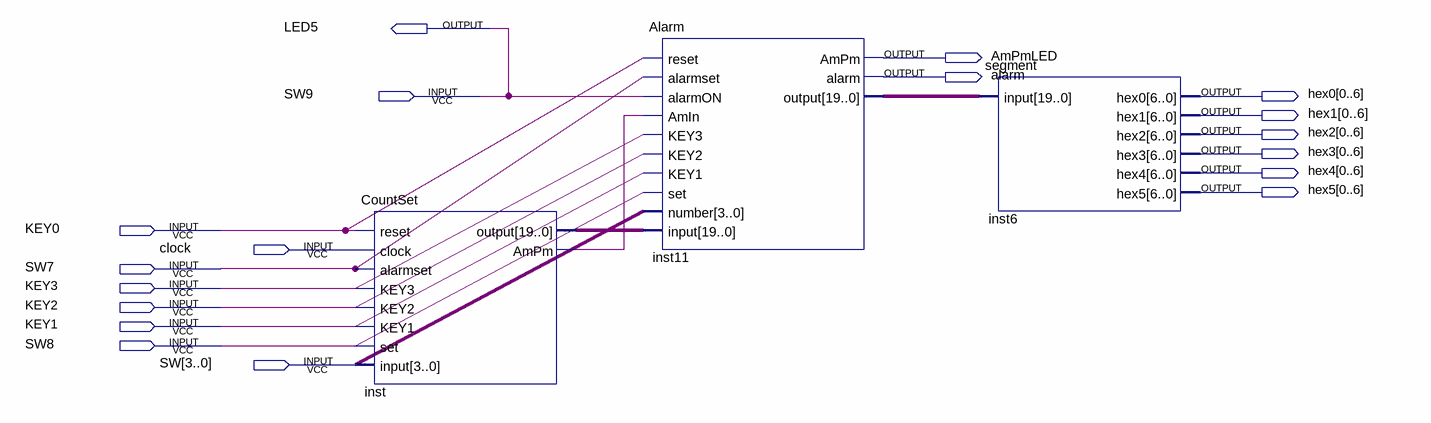
[diagram p0: schematic sheet]
// Quartus schematic Lab3.bdf as structural Verilog: 3 symbols, 18 pins
module Lab3 (
  input  SW9,
  input  KEY0,
  input  clock,
  input  SW7,
  input  KEY3,
  input  KEY2,
  input  KEY1,
  input  SW8,
  input  [3:0] SW,
  output LED5,
  output AmPmLED,
  output alarm,
  output [0:6] hex0,
  output [0:6] hex1,
  output [0:6] hex2,
  output [0:6] hex3,
  output [0:6] hex4,
  output [0:6] hex5
);

  wire inst_ampm;
  wire [19:0] inst11_output, inst_output;

  CountSet inst (
    .reset(KEY0), .clock(clock), .alarmset(SW7), .KEY3(KEY3), .KEY2(KEY2), .KEY1(KEY1), .set(SW8),
    .\input (SW), .\output (inst_output), .AmPm(inst_ampm));
  Alarm inst11 (
    .reset(KEY0), .alarmset(SW7), .alarmON(SW9), .AmIn(inst_ampm), .KEY3(KEY3), .KEY2(KEY2), .KEY1(KEY1),
    .set(SW8), .number(SW), .\input (inst_output), .AmPm(AmPmLED), .alarm(alarm), .\output (inst11_output));
  segment inst6 (.\input (inst11_output), .hex0(hex0), .hex1(hex1), .hex2(hex2), .hex3(hex3), .hex4(hex4), .hex5(hex5));

  assign LED5 = SW9;
endmodule
